# EAGLE design knob-ross-test1 (EAGLE 9.6.2)
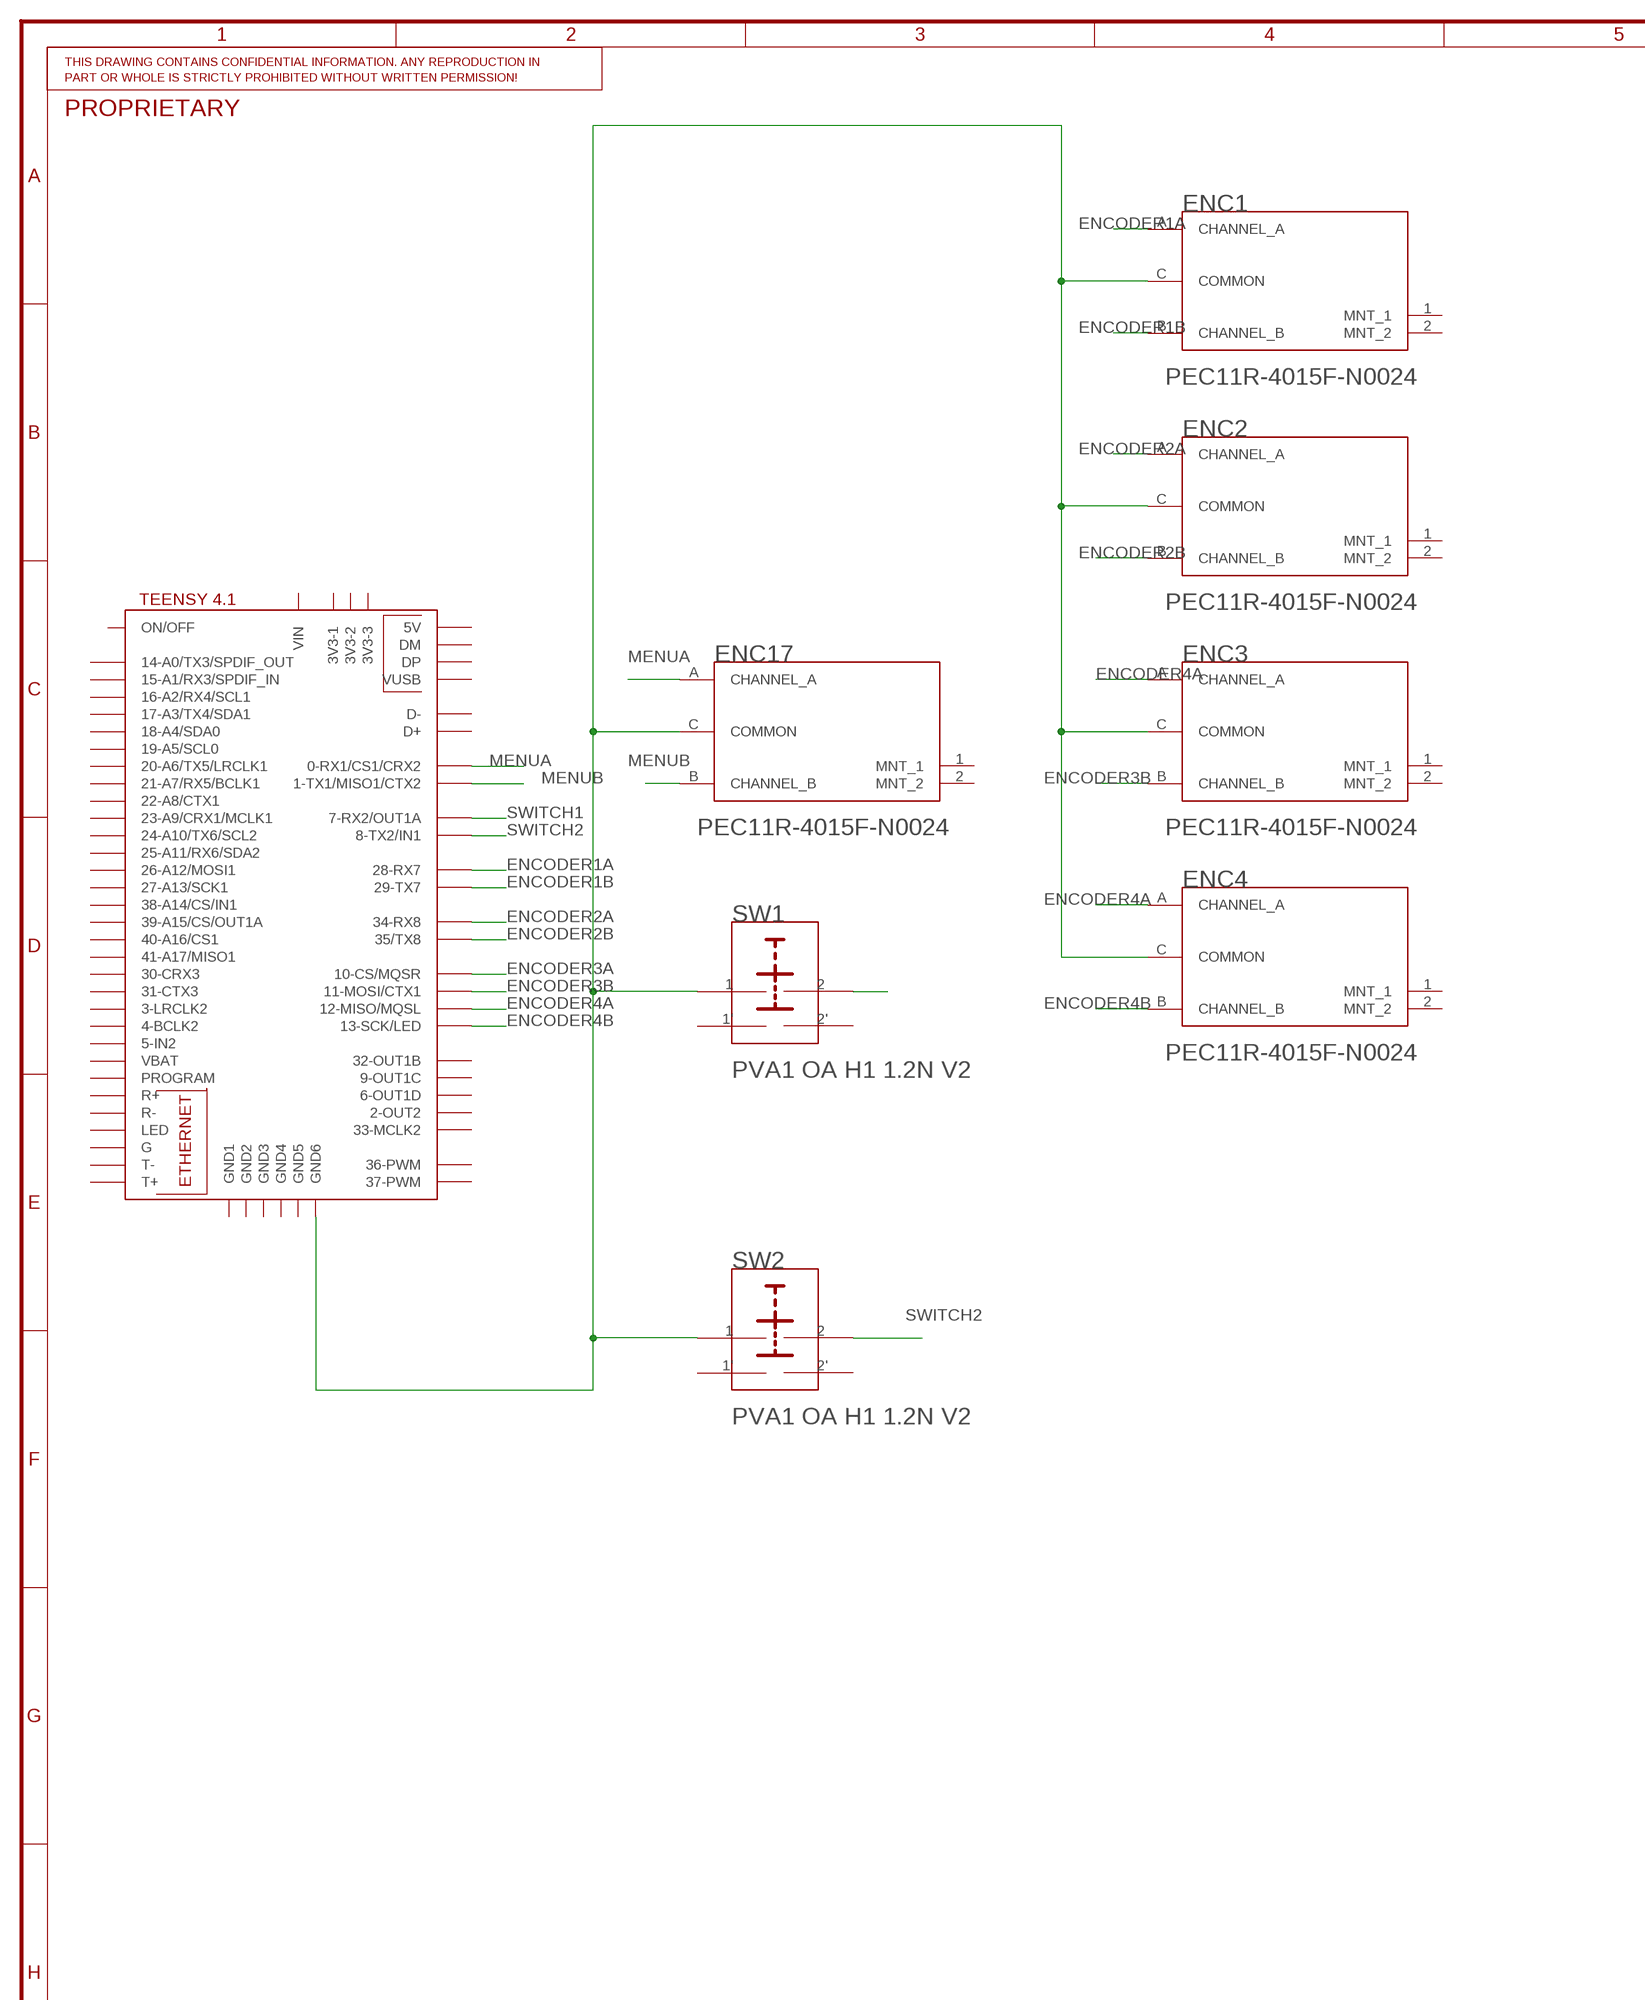
[diagram p0: schematic, sheet 1, part 1 of 2]
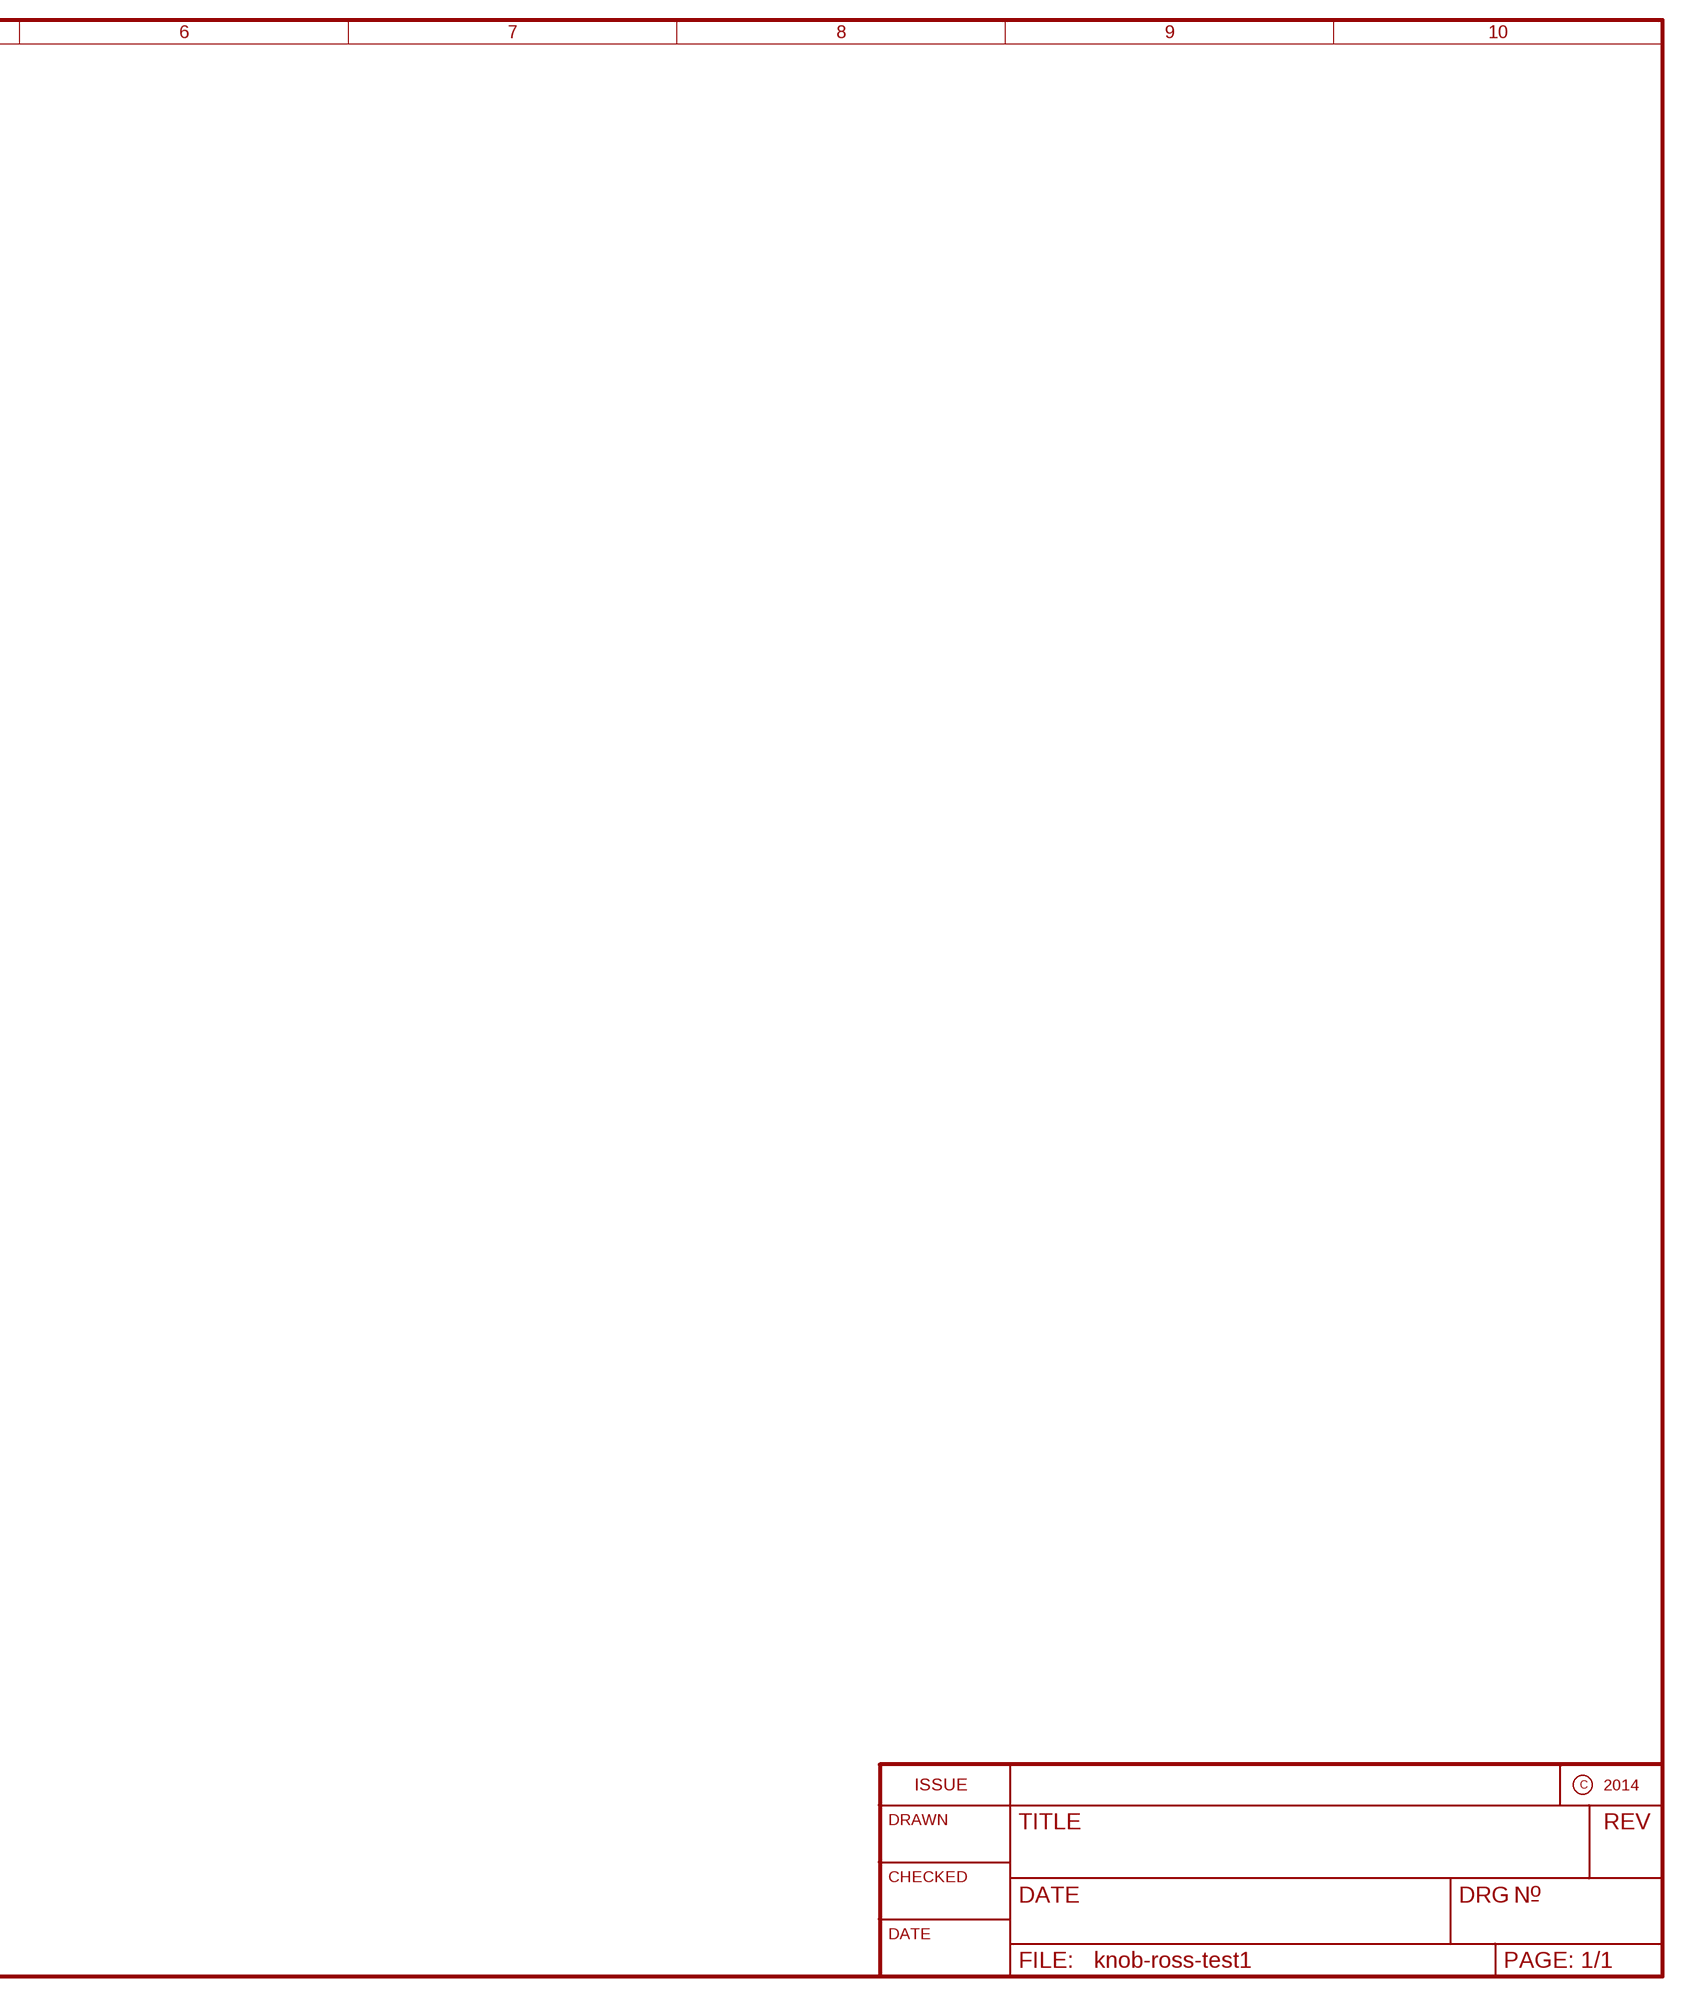
[diagram p1: schematic, sheet 1, part 2 of 2]

## Parts
ENC1  BOURNS_PEC11R-4015F-N0024BOURNS_PEC11R-4015F-N0024_0_0  [BOURNS_PEC11R-4015F-N0024_0]
ENC2  BOURNS_PEC11R-4015F-N0024BOURNS_PEC11R-4015F-N0024_0_0  [BOURNS_PEC11R-4015F-N0024_0]
ENC3  BOURNS_PEC11R-4015F-N0024BOURNS_PEC11R-4015F-N0024_0_0  [BOURNS_PEC11R-4015F-N0024_0]
ENC4  BOURNS_PEC11R-4015F-N0024BOURNS_PEC11R-4015F-N0024_0_0  [BOURNS_PEC11R-4015F-N0024_0]
ENC17  BOURNS_PEC11R-4015F-N0024BOURNS_PEC11R-4015F-N0024_0_0  [BOURNS_PEC11R-4015F-N0024_0]
SW1  C&K_COMPONENTS_PVA1_OA_H1_1_2N_V2C&K_COMPONENTS_PVA1_OA_H1_1_2N_V2_0_0  [C&K_COMPONENTS_PVA1_OA_H1_1_2N_V2_0]
SW2  C&K_COMPONENTS_PVA1_OA_H1_1_2N_V2C&K_COMPONENTS_PVA1_OA_H1_1_2N_V2_0_0  [C&K_COMPONENTS_PVA1_OA_H1_1_2N_V2_0]
U$1  TEENSY41  [TEENSY41]

## Nets
ENCODER1A: ENC1.A(CHANNEL_A) U$1.28-RX7
ENCODER1B: ENC1.B(CHANNEL_B) U$1.29-TX7
ENCODER2A: ENC2.A(CHANNEL_A) U$1.34-RX8
ENCODER2B: ENC2.B(CHANNEL_B) U$1.35-TX8(35/TX8)
ENCODER3A: U$1.10-CS\MQSR(10-CS/MQSR)
ENCODER3B: ENC3.B(CHANNEL_B) U$1.11-MOSI/CTX1
ENCODER4A: ENC3.A(CHANNEL_A) ENC4.A(CHANNEL_A) U$1.12-MISO/MQSL
ENCODER4B: ENC4.B(CHANNEL_B) U$1.13-SCK/LED
MENUA: ENC17.A(CHANNEL_A) U$1.0-RX1/CS1/CRX2
MENUB: ENC17.B(CHANNEL_B) U$1.1-TX1/MISO1/CTX2
N$1: ENC1.C(COMMON) ENC2.C(COMMON) ENC3.C(COMMON) ENC4.C(COMMON) ENC17.C(COMMON) SW1.1 SW2.1 U$1.GND6
SWITCH1: SW1.2 U$1.7-RX2/OUT1A
SWITCH2: SW2.2 U$1.8-TX2/IN1
Unconnected: ENC1.1(MNT_1) ENC1.2(MNT_2) ENC2.1(MNT_1) ENC2.2(MNT_2) ENC3.1(MNT_1) ENC3.2(MNT_2) ENC4.1(MNT_1) ENC4.2(MNT_2) ENC17.1(MNT_1) ENC17.2(MNT_2) SW1.1' SW1.2' SW2.1' SW2.2' U$1.2-OUT2 U$1.3-LRCLK2 U$1.3V3-1 U$1.3V3-2 U$1.3V3-3 U$1.4-BCLK2 U$1.5-IN2 U$1.6-OUT1D U$1.9-OUT1C U$1.14-A0/TX3/SPDIF_OUT U$1.15-A1/RX3/SPDIF_IN U$1.16-A2/RX4/SCL1 U$1.17-A3/TX4/SDA1 U$1.18-A4/SDA0 U$1.19-A5/SCL0 U$1.20-A6/TX5/LRCLK1 U$1.21-A7/RX5/BCLK1 U$1.22-A8/CTX1 U$1.23-A9/CRX1/MCLK1 U$1.24-A10/TX6/SCL2 U$1.25-A11/RX6/SDA2 U$1.26-A12/MOSI1 U$1.27-A13/SCK1 U$1.30-CRX3 U$1.31-CTX3 U$1.32-OUT1B U$1.33-MCLK2 U$1.36-PWM U$1.37-PWM U$1.38-A14/CS/IN1 U$1.39-A15/CS/OUT1A U$1.40-A16/CS1 U$1.41-A17/MISO1 U$1.+5V(5V) U$1.D+ U$1.D- U$1.DM U$1.DP U$1.G U$1.GND1 U$1.GND2 U$1.GND3 U$1.GND4 U$1.GND5 U$1.LED U$1.ON/OFF U$1.PROGRAM U$1.R+ U$1.R- U$1.T+ U$1.T- U$1.VBAT U$1.VIN U$1.VUSB

## Library data of the parts
ENC1-ENC4 ENC17 = Bourns - PEC11R-4015F-N0024:BOURNS_PEC11R-4015F-N0024: Rotary Encoder Mechanical 24 Quadrature (Incremental) Vertical; AUTOMOTIVE: No; CENTROID_NOT_SPECIFIED: No; CONN_ORIENTATION: Vertical; CURRENT_RATING: 10mA; DATASHEET: https://www.bourns.com/docs/product-datasheets/pec11r.pdf?sfvrsn=bb617cbf_7; DETENT: No; DEVICE_CLASS_L1: Electromechanical; DEVICE_CLASS_L2: Switches; DEVICE_CLASS_L3: Encoders; DIGIKEY_DESCRIPTION: ROTARY ENCODER MECHANICAL 24PPR; DIGIKEY_PART_NUMBER: PEC11R-4015F-N0024-ND; ENCODER_TYPE: Incremental; FOOTPRINT_VARIANT_NAME_0: Recommended_Land_Pattern; HEIGHT: 22.3mm; LEAD_FREE: Yes; MF: Bourns; MFG_PACKAGE_IDENT: 0; MFG_PACKAGE_IDENT_DATE: 0; MFG_PACKAGE_IDENT_REV: 0; MOUSER_DESCRIPTION: Encoders 15mm SHAFT NO SWITCH; MOUSER_PART_NUMBER: 652-PEC11R-4015F-N24; MPN: PEC11R-4015F-N0024; NUMBER_OF_CIRCUITS: 1; PACKAGE: PTH_ENC_12MM5_13MM4; PREFIX: ENC; PULSES_PER_REV: 24; ROHS: Yes; TEMPERATURE_RANGE_HIGH: +70°C; TEMPERATURE_RANGE_LOW: -30°C; VERIFICATION_VERSION: 0.0.0.3; VOLTAGE_RATING_DC: 5V
SW1 SW2 = C&K Components - PVA1 OA H1 1.2N V2:C&K_COMPONENTS_PVA1_OA_H1_1_2N_V2: Pushbutton Switch DPST-NO Keyswitch Through Hole; AUTOMOTIVE: No; CENTROID_NOT_SPECIFIED: No; CONTACT_CURRENT_RATING: 100mA; CONTACT_RESISTANCE: 100mΩ; DATASHEET: https://www.ckswitches.com/media/1343/pva.pdf; DEVICE_CLASS_L1: Electromechanical; DEVICE_CLASS_L2: Switches; DEVICE_CLASS_L3: Pushbutton Switches; DIGIKEY_DESCRIPTION: SWITCH PUSH DPST-NO 0.1A 32V; DIGIKEY_PART_NUMBER: 401-1133-ND; ELECTROMECHANICAL_LIFE: 100000Cycles; FOOTPRINT_VARIANT_NAME_0: Recommended_Land_Pattern; HEIGHT: 17.74mm; LEAD_FREE: Yes; MF: C&K Components; MFG_PACKAGE_IDENT: 0; MFG_PACKAGE_IDENT_DATE: 0; MFG_PACKAGE_IDENT_REV: 0; MOUNT: Through Hole; MOUSER_DESCRIPTION: Switch Key N.O./N.C. DPST 0.1A 32VDC 3VA 1.2N PC Pins Thru-Hole Automotive Bulk; MOUSER_PART_NUMBER: 611-PVA1OAH11.2NV2; MPN: PVA1 OA H1 1.2N V2; OPERATING_FORCE: 1.2N; PACKAGE: PTH_SW_9MM2_9MM8; PREFIX: SW; ROHS: Yes; TEMPERATURE_RANGE_HIGH: +85°C; TEMPERATURE_RANGE_LOW: -40°C; THROW_CONFIGURATION: DPST-NO; VERIFICATION_VERSION: 0.0.0.3; VOLTAGE_RATING_DC: 32V
U$1 = teensy jason:TEENSY41: Teensy 4.1

## Board
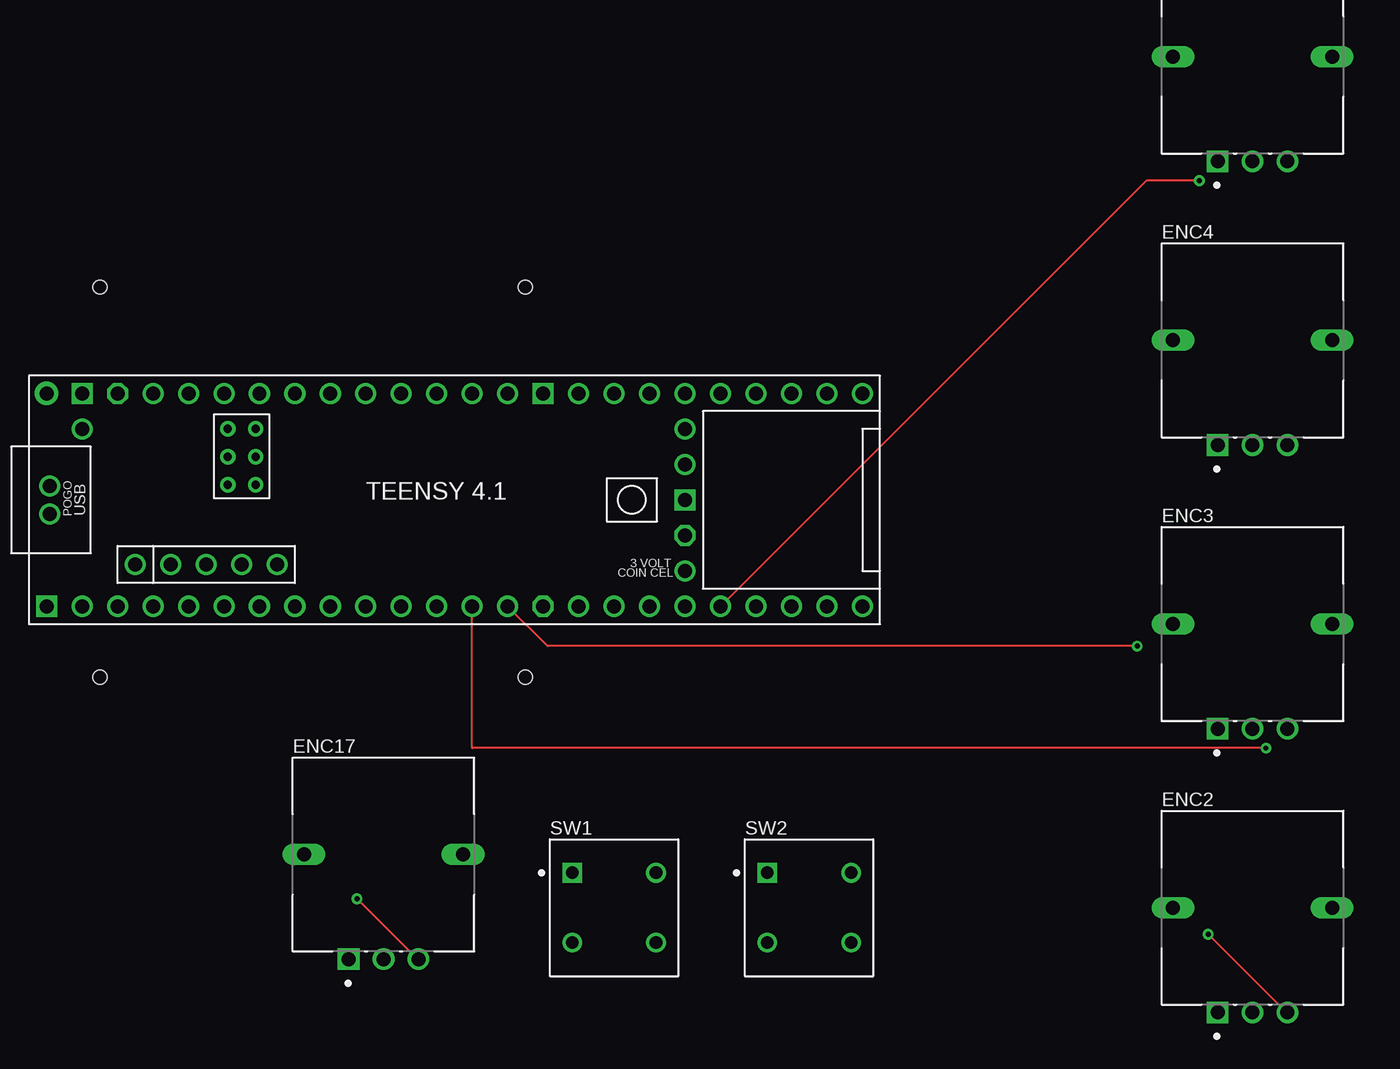
[diagram p2: board, top side]
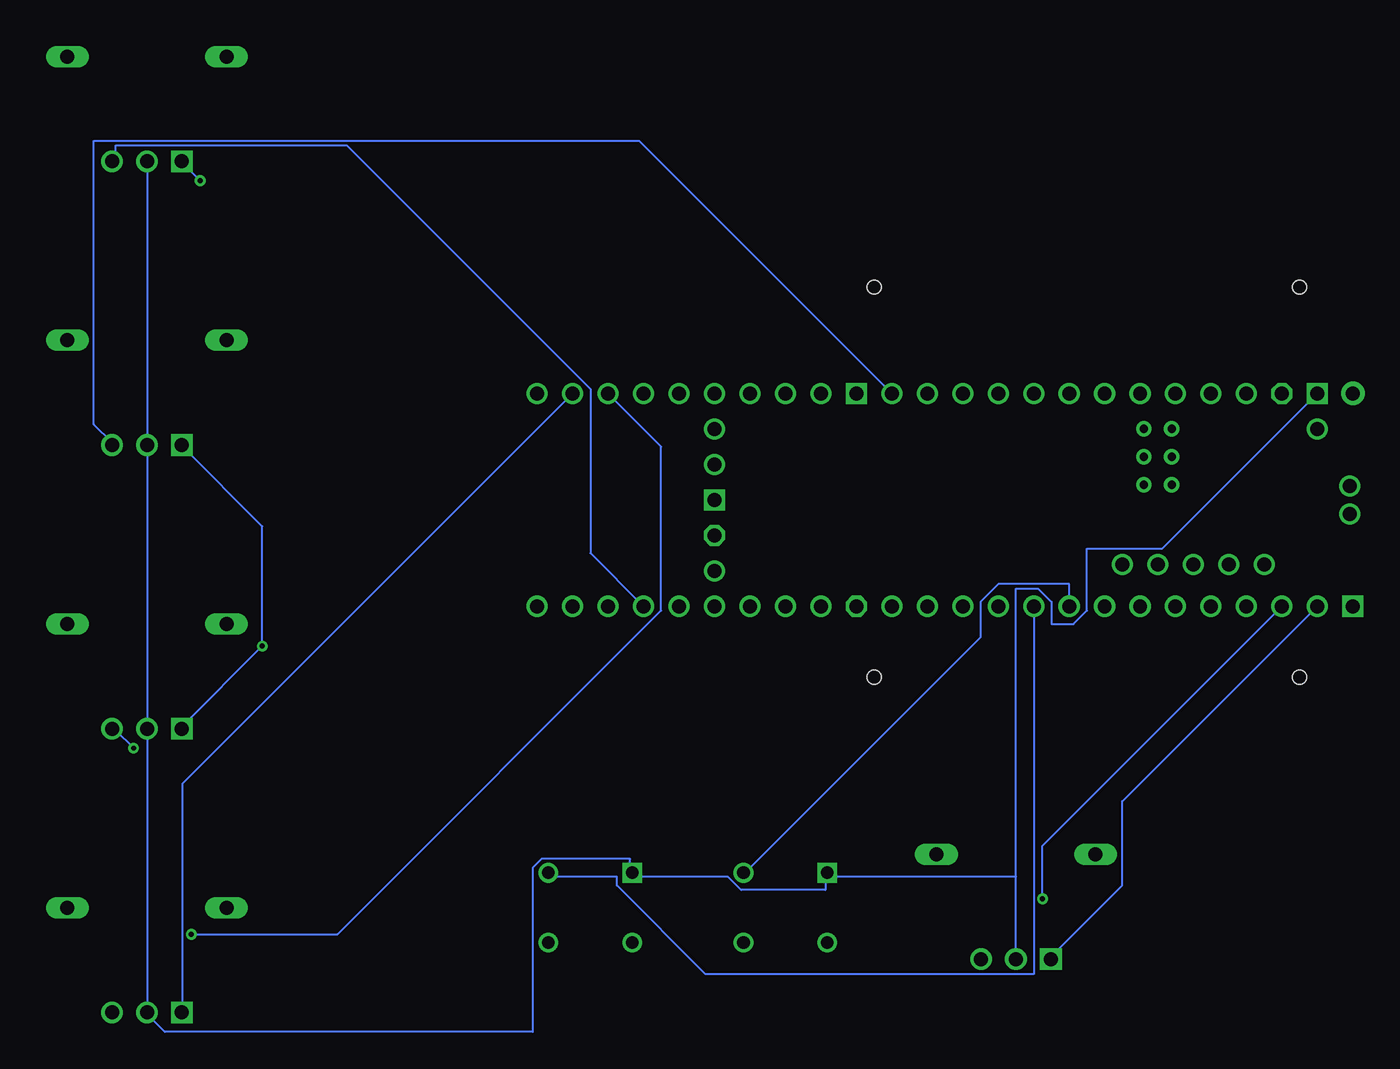
[diagram p3: board, bottom side, seen from below]

No outline drawn. Coordinates in mm, seen from the top.
Copper layers (1*16): Top 0.035mm / dielectric 1.5mm / Bottom 0.035mm
Design rules "default": minimum track width 6mil, minimum drill 0.35mm, track to track 6mil, track to pad 6mil, pad to pad 6mil, via to via 6mil, smd to smd 6mil, copper to edge 40mil, drill to drill 6mil, minimum pad ring 10mil, minimum via ring 8mil, stop-mask expansion 4mil, vias tented up to drill 0mil, thermal gap 10mil
Holes 1 mm at 7.62,26.67 7.62,54.61 38.1,54.61 38.1,26.67

### Footprints (pad centres in the part's own frame; a part is rotated, then mirrored left to right if it is on the bottom)
BOURNS_PEC11R-4015F-N0024_0 = drill 1 pad 1.55 long: 1 -5.7,0; 2 5.7,0 | drill 1 pad 1.55 square: A -2.5,-7.5 | drill 1 pad 1.55: B 2.5,-7.5; C 0,-7.5
C&K_COMPONENTS_PVA1_OA_H1_1_2N_V2_0 = drill 0.9 pad 1.4 square: 1 -3,2.5 | drill 0.9 pad 1.4: 1' -3,-2.5; 2 3,2.5; 2' 3,-2.5
TEENSY41 = drill 1: 0-RX1/CS1/CRX2 -27.94,-7.62; 1-TX1/MISO1/CTX2 -25.4,-7.62; 2-OUT2 -22.86,-7.62; 3-LRCLK2 -20.32,-7.62; 4-BCLK2 -17.78,-7.62; 5-IN2 -15.24,-7.62; 6-OUT1D -12.7,-7.62; 7-RX2/OUT1A -10.16,-7.62; 8-TX2/IN1 -7.62,-7.62; 9-OUT1C -5.08,-7.62; 10-CS\MQSR -2.54,-7.62; 11-MOSI/CTX1 0,-7.62; 12-MISO/MQSL 2.54,-7.62; 13-SCK/LED 2.54,7.62; 14-A0/TX3/SPDIF_OUT 0,7.62; 15-A1/RX3/SPDIF_IN -2.54,7.62; 16-A2/RX4/SCL1 -5.08,7.62; 17-A3/TX4/SDA1 -7.62,7.62; 18-A4/SDA0 -10.16,7.62; 19-A5/SCL0 -12.7,7.62; 20-A6/TX5/LRCLK1 -15.24,7.62; 21-A7/RX5/BCLK1 -17.78,7.62; 22-A8/CTX1 -20.32,7.62; 23-A9/CRX1/MCLK1 -22.86,7.62; 24-A10/TX6/SCL2 7.62,-7.62; 25-A11/RX6/SDA2 10.16,-7.62; 26-A12/MOSI1 12.7,-7.62; 27-A13/SCK1 15.24,-7.62; 28-RX7 17.78,-7.62; 29-TX7 20.32,-7.62; 30-CRX3 22.86,-7.62; 31-CTX3 25.4,-7.62; 32-OUT1B 27.94,-7.62; 33-MCLK2 27.94,7.62; 34-RX8 25.4,7.62; 35-TX8 22.86,7.62; 36-PWM 20.32,7.62; 37-PWM 17.78,7.62; 38-A14/CS/IN1 15.24,7.62; 39-A15/CS/OUT1A 12.7,7.62; 40-A16/CS1 10.16,7.62; 41-A17/MISO1 7.62,7.62; +5V -24.13,-4.62; D+ -30.25,-1; D- -30.25,1; DM -21.59,-4.62; DP -19.05,-4.62; GND4 -16.51,-4.62; GND5 -13.97,-4.62; ON/OFF 15.24,5.08; PROGRAM 15.24,2.54; VBAT 15.24,-5.08; VUSB -27.94,5.08 | drill 1 octagon: 3V3-1 5.08,-7.62; 3V3-2 15.24,-2.54; 3V3-3 -25.4,7.62 | drill 0.6: G -15.51,3.08; LED -17.51,3.08; R+ -17.51,5.08; R- -15.51,5.08; T+ -15.51,1.08; T- -17.51,1.08 | drill 1 square: GND1 -30.48,-7.62; GND2 15.24,0; GND3 5.08,7.62; GND6 -27.94,7.62 | drill 1 pad 1.676: VIN -30.48,7.62

### Placement (x,y rotation side)
ENC1  90.17,71.12 0 top
ENC2  90.17,10.16 0 top
ENC3  90.17,30.48 0 top
ENC4  90.17,50.8 0 top
ENC17  27.94,13.97 0 top
SW1  44.45,10.16 0 top
SW2  58.42,10.16 0 top
U$1  34.29,39.37 0 top

### Tracks (layer width: path | path; a pad name or v marks a point on that pad's centre or on a via)
ENCODER1A  (via drill 0.35)
  Top 0.152: U$1.28-RX7 82.55,62.23 v86.36,62.23
  Bottom 0.152: v86.36,62.23 87.63,63.5 ENC1.A
ENCODER1B
  Bottom 0.152: U$1.29-TX7 58.42,35.56 58.42,47.31 75.88,64.77 92.39,64.77 92.39,63.82 ENC1.B
ENCODER2A
  Bottom 0.152: U$1.34-RX8 87.63,19.05 87.63,2.86 ENC2.A
ENCODER2B  (via drill 0.35)
  Top 0.152: v87,8.26 92.39,2.86 ENC2.B
  Bottom 0.152: U$1.35-TX8 53.34,43.18 53.34,31.43 76.52,8.26 v87,8.26
ENCODER3B  (via drill 0.35)
  Top 0.152: U$1.11-MOSI/CTX1 34.29,21.59 v91.12,21.59
  Bottom 0.152: v91.12,21.59 92.39,22.86 ENC3.B
ENCODER4A  (via drill 0.35)
  Top 0.152: U$1.12-MISO/MQSL 39.69,28.89 v81.92,28.89
  Bottom 0.152: ENC3.A 87.63,23.18 v81.92,28.89 81.92,37.47 87.63,43.18 ENC4.A
ENCODER4B
  Bottom 0.152: U$1.13-SCK/LED 54.93,65.09 93.98,65.09 93.98,44.77 92.71,43.5 ENC4.B
MENUA
  Bottom 0.152: U$1.0-RX1/CS1/CRX2 20.32,17.78 20.32,11.75 25.4,6.67 ENC17.A
MENUB  (via drill 0.35)
  Top 0.152: v26.04,10.79 30.16,6.67 ENC17.B
  Bottom 0.152: U$1.1-TX1/MISO1/CTX2 26.04,14.61 v26.04,10.79
N$1
  Bottom 0.152: ENC1.C ENC4.C ENC3.C ENC2.C 90.17,2.54 88.9,1.27 62.55,1.27 62.55,13.02 61.91,13.65 55.56,13.65 55.56,12.7 SW2.1 55.24,12.38 48.58,12.38 47.62,11.43 41.59,11.43 41.59,12.38 SW1.1 41.27,12.38 27.94,12.38 | ENC17.C 27.94,12.38 | U$1.GND6 17.46,35.88 22.86,35.88 22.86,31.43 23.81,30.48 25.4,30.48 25.4,32.07 26.35,33.02 27.94,33.02 27.94,12.38
SWITCH1
  Bottom 0.152: U$1.7-RX2/OUT1A 24.13,33.34 29.21,33.34 30.48,32.07 30.48,29.53 47.31,12.7 SW1.2
SWITCH2
  Bottom 0.152: U$1.8-TX2/IN1 26.67,5.4 50.16,5.4 56.52,11.75 56.52,12.38 61.28,12.38 SW2.2